# Altium schematic sheet LVDS.SchDoc: Evaluation Board 3.2
size A3; Organization: Toradex AG; Address1: Altsagenstrasse 5; Address2: Horw; Address3: 6048; Address4: Switzerland; DocumentNumber: 17; Revision: V3.2; SheetNumber: 17; SheetTotal: 23; PageSetup: Record=PageOptions|CenterHorizontal=True|CenterVertical=True|PrintScale=0.73|XCorrection=1.00|YCorrection=1.00|PrintKind=0|BorderSize=5000000|LeftOffset=0|BottomOffset=0|Orientation=2|PaperLength=1000|PaperWidth=1000|Scale=100|PaperSource=7|PrintQuality=-4|MediaType=1|DitherType=10|PaperKind=A4|PrintScaleMode=1
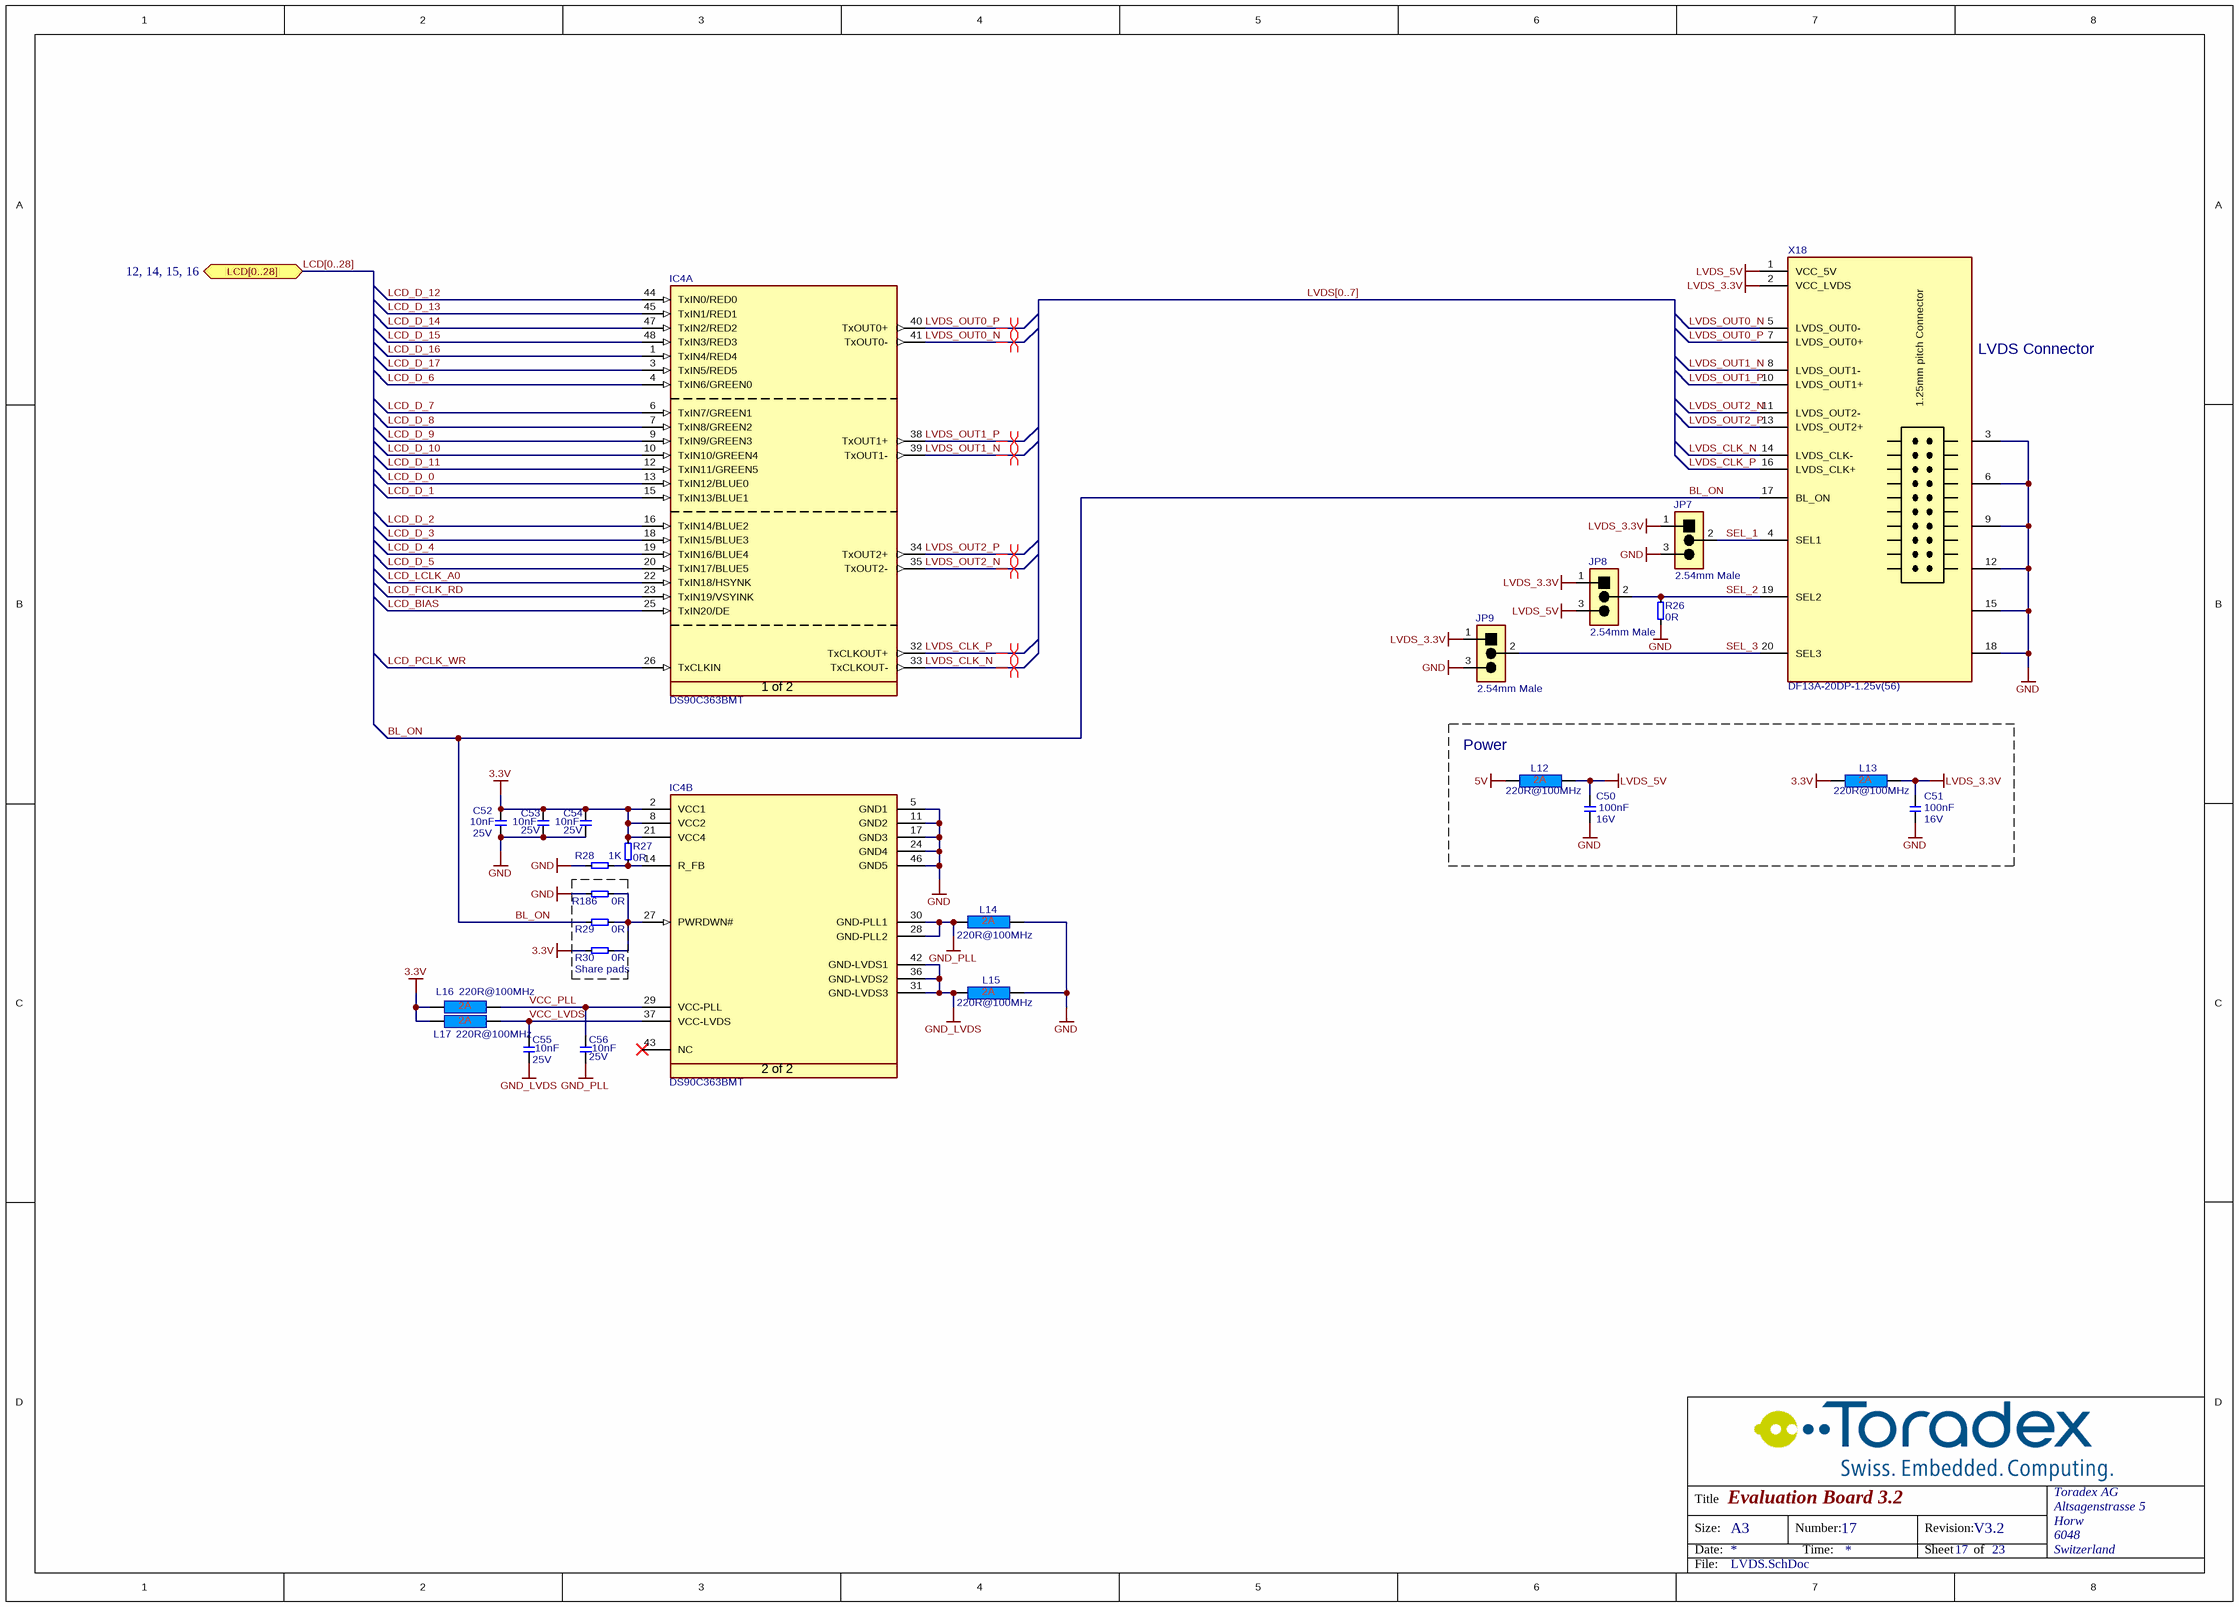
[diagram p0: LVDS.SchDoc]

## Parts
C50  Rating: 16V  [T_CAPC0603X33N]  (hidden comment: 100nF)
C51  Rating: 16V  [T_CAPC0603X33N]  (hidden comment: 100nF)
C52  Rating: 25V  [T_CAPC0603X33N]  (hidden comment: 10nF)
C53  Rating: 25V  [T_CAPC0603X33N]  (hidden comment: 10nF)
C54  Rating: 25V  [T_CAPC0603X33N]  (hidden comment: 10nF)
C55  Rating: 25V  [T_CAPC0603X33N]  (hidden comment: 10nF)
C56  Rating: 25V  [T_CAPC0603X33N]  (hidden comment: 10nF)
IC4  DS90C363BMT  [SOP50P810X120-48N]  (parts A,B of 2)
JP7  826936-3  [T_TYCO_826936-3]  (value not drawn)
JP8  826936-3  [T_TYCO_826936-3]  (value not drawn)
JP9  826936-3  [T_TYCO_826936-3]  (value not drawn)
L12  220R@100MHz  [INDC1608X95N]
L13  220R@100MHz  [INDC1608X95N]
L14  220R@100MHz  [INDC1608X95N]
L15  220R@100MHz  [INDC1608X95N]
L16  220R@100MHz  [INDC1608X95N]
L17  220R@100MHz  [INDC1608X95N]
R26  0R  [t_RESC0603X30N]
R27  0R  [t_RESC0603X30N]
R28  1K  [t_RESC0603X30N]
R29  0R  [t_RESC0603X30N]
R30  0R  [t_RESC0603X30N]
R186  0R  [t_RESC0603X30N]
X18  Manufacturer Part No.: DF13A-20DP-1.25v(56)  [T_HIROSE_DF13A-20DP-1.25V(56)]  (hidden comment: CON-Hirose-DF13A-20DP-1.25v(56)-2x10-1mm)

## Blocks framed on the sheet
Power: C50 C51 L12 L13
Share pads: R29 R30 R186

## Ports
LCD[0..28] (bidir, see 12, 14, 15, 16)

## Nets
3.3V: C52.2 C53.2 C54.2 IC4.2(VCC1) IC4.8(VCC2) IC4.21(VCC4) L13.1 L16.1 L17.1 R27.2 R30.1
5V: L12.1
GND: C50.1 C51.1 C52.1 C53.1 C54.1 IC4.5(GND1) IC4.11(GND2) IC4.17(GND3) IC4.24(GND4) IC4.46(GND5) JP7.3 JP9.3 L14.2 L15.2 R26.1 R28.1 R186.1 X18.3(GND) X18.6(GND) X18.9(GND) X18.12(GND) X18.15(GND) X18.18(GND)
GND_LVDS: C55.1 IC4.31(GND-LVDS3) IC4.36(GND-LVDS2) IC4.42(GND-LVDS1) L15.1
GND_PLL: C56.1 IC4.28(GND-PLL2) IC4.30(GND-PLL1) L14.1
LVDS_3.3V: C51.2 JP7.1 JP8.1 JP9.1 L13.2 X18.2(VCC_LVDS)
LVDS_5V: C50.2 JP8.3 L12.2 X18.1(VCC_5V)
BL_ON: R29.1 X18.17(BL_ON)
LCD_BIAS: IC4.25(TxIN20/DE)
LCD_D_0: IC4.13(TxIN12/BLUE0)
LCD_D_1: IC4.15(TxIN13/BLUE1)
LCD_D_2: IC4.16(TxIN14/BLUE2)
LCD_D_3: IC4.18(TxIN15/BLUE3)
LCD_D_4: IC4.19(TxIN16/BLUE4)
LCD_D_5: IC4.20(TxIN17/BLUE5)
LCD_D_6: IC4.4(TxIN6/GREEN0)
LCD_D_7: IC4.6(TxIN7/GREEN1)
LCD_D_8: IC4.7(TxIN8/GREEN2)
LCD_D_9: IC4.9(TxIN9/GREEN3)
LCD_D_10: IC4.10(TxIN10/GREEN4)
LCD_D_11: IC4.12(TxIN11/GREEN5)
LCD_D_12: IC4.44(TxIN0/RED0)
LCD_D_13: IC4.45(TxIN1/RED1)
LCD_D_14: IC4.47(TxIN2/RED2)
LCD_D_15: IC4.48(TxIN3/RED3)
LCD_D_16: IC4.1(TxIN4/RED4)
LCD_D_17: IC4.3(TxIN5/RED5)
LCD_FCLK_RD: IC4.23(TxIN19/VSYINK)
LCD_LCLK_A0: IC4.22(TxIN18/HSYNK)
LCD_PCLK_WR: IC4.26(TxCLKIN)
LVDS_CLK_N: IC4.33(TxCLKOUT-) X18.14(LVDS_CLK-)
LVDS_CLK_P: IC4.32(TxCLKOUT+) X18.16(LVDS_CLK+)
LVDS_OUT0_N: IC4.41(TxOUT0-) X18.5(LVDS_OUT0-)
LVDS_OUT0_P: IC4.40(TxOUT0+) X18.7(LVDS_OUT0+)
LVDS_OUT1_N: IC4.39(TxOUT1-) X18.8(LVDS_OUT1-)
LVDS_OUT1_P: IC4.38(TxOUT1+) X18.10(LVDS_OUT1+)
LVDS_OUT2_N: IC4.35(TxOUT2-) X18.11(LVDS_OUT2-)
LVDS_OUT2_P: IC4.34(TxOUT2+) X18.13(LVDS_OUT2+)
SEL_1: JP7.2 X18.4(SEL1)
SEL_2: JP8.2 R26.2 X18.19(SEL2)
SEL_3: JP9.2 X18.20(SEL3)
VCC_LVDS: C55.2 IC4.37(VCC-LVDS) L17.2
VCC_PLL: C56.2 IC4.29(VCC-PLL) L16.2
NetIC4_14: IC4.14(R_FB) R27.1 R28.2
NetIC4_27: IC4.27(PWRDWN#) R29.2 R30.2 R186.2

Not connected (* = marked no-connect by the designer): IC4 43(NC)*

## Buses and harness runs
bus LCD[0..28] = port LCD[0..28]
bus LVDS[0..7]

## Layout directives
differential pair: LVDS_CLK_N, LVDS_CLK_P, LVDS_OUT0_N, LVDS_OUT0_P, LVDS_OUT1_N, LVDS_OUT1_P, LVDS_OUT2_N, LVDS_OUT2_P

## Notes on the sheet
- (near X18) LVDS Connector
- 2.54mm Male
- (near JP9) 2.54mm Male
- Title
- Size:
- Date:
- A3
- Number:
- Time:
- Revision:
- Sheet
- of
- File:
- (in symbol CON-Hirose-DF13A-20DP-1.25v(56)-2x10-1mm) 1.25mm pitch Connector
- (in symbol IC-NS-DS90C363BMT, part A) 1 of 2
- (in symbol IC-NS-DS90C363BMT, part B) 2 of 2

## Library data of the parts
C50 C51 = C-X7R-100nF-16V-10%-0603: Capacitor Ceramic X7R 100nF 16V 10% 0603; Tolerance: 10%; Type: X7R; Value: 100nF
C52-C56 = C-X7R-10nF-25V-10%-0603: Capacitor Ceramic X7R 10nF 25V 10% 0603; Tolerance: 10%; Type: X7R; Value: 10nF
IC4 = IC-NS-DS90C363BMT: LVDS Converter; Manufacturer Name: National Semiconductor; Manufacturer Part No.: DS90C363BMT
JP7-JP9 = CON-Tyco-826936-3-1X3-2.54mm-JP: Jumper, 3-Pin; Manufacturer Name: Tyco; No. of ways: 1X3; Pitch: 2.54mm; Manufacturer Part No.: 826936-3
L12-L17 = L-220R@100MHz-2A-25%-0603: 220R@100MHz 2A EMI FILTER; Tolerance: 25%; Rating: 2A; Value: 220R@100MHz
R26 R27 R29 R30 R186 = R-0R-63mW-1%-0603: Resistor 0 ohm 63mW 1% 0603; Rating: 63mW; Tolerance: 1%; Value: 0R
R28 = R-1KR-63mW-5%-0603: Resistor 1 Kohm 63mW 5% 0603; Rating: 63mW; Tolerance: 5%; Value: 1K
X18 = CON-Hirose-DF13A-20DP-1.25v(56)-2x10-1mm: LVDS Connector; Manufacturer Name: Hirose; No. of ways: 2x10; Pitch: 1mm